# EasyEDA Pro project 51单片机核心板.eprj

# Schematic 51单片机核心板原理图
Board Name: 51单片机核心板; Create Date: 2025-05-13; Page Name: P1; Project Name: 51单片机核心板; Schematic Name: 51单片机核心板原理图; Update Date: 2025-05-13; Company: 辽宁工业大学; Drawed: 含生; Page Size: A4; Version: V1.0
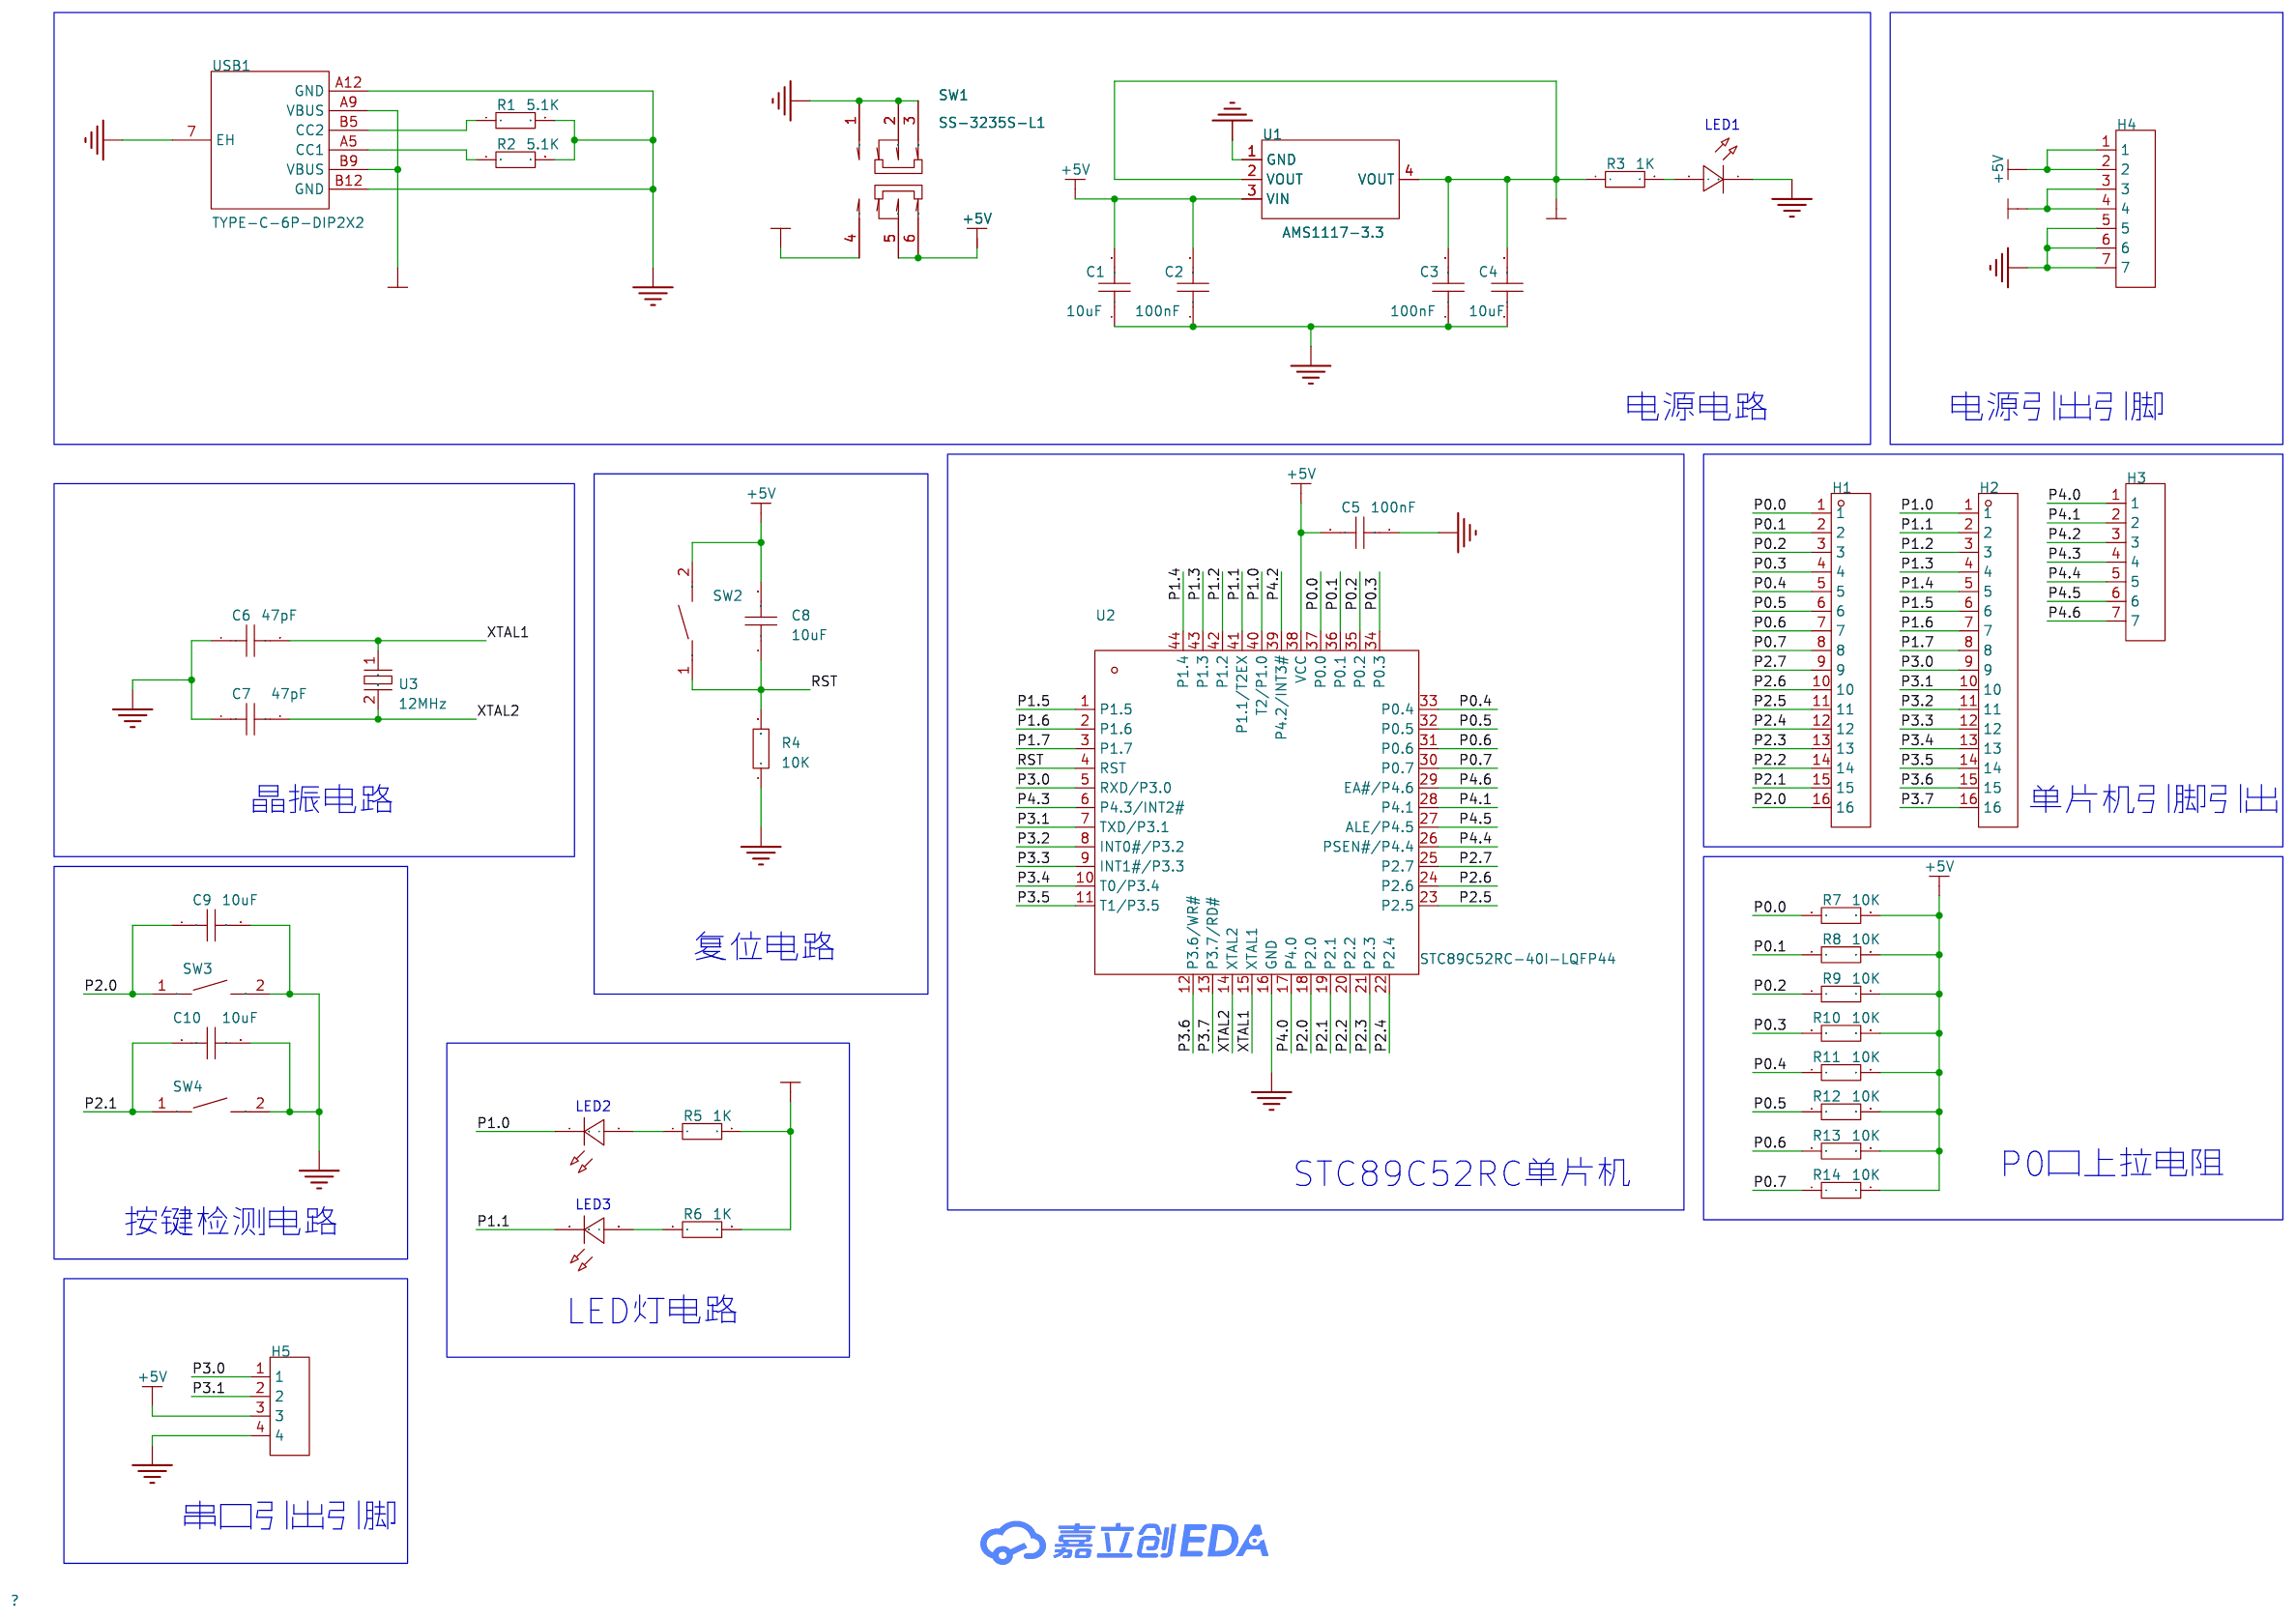
[diagram p0: schematic sheet]

## Parts
C1  10uF  [C0805]
C2  100nF  [C0805]
C3  100nF  [C0805]
C4  10uF  [C0805]
C5  100nF  [C0805]
C6  47pF  [C0805]
C7  47pF  [C0805]
C8  10uF  [C0805]
C9  10uF  [C0805]
C10  10uF  [C0805]
H1  -  [HDR-TH_16P-P2.54-V-M]
H2  -  [HDR-TH_16P-P2.54-V-M]
H3  -  [HDR-TH_7P-P2.54-V-M]
H4  -  [HDR-TH_7P-P2.54-V-M]
H5  -  [HDR-TH_4P-P2.54-V-M]
LED1  -  [LED_0805]
LED2  -  [LED_0805]
LED3  -  [LED_0805]
R1  5.1K  [R0805]
R2  5.1K  [R0805]
R3  1K  [R0805]
R4  10K  [R0805]
R5  1K  [R0805]
R6  1K  [R0805]
R7  10K  [R0805]
R8  10K  [R0805]
R9  10K  [R0805]
R10  10K  [R0805]
R11  10K  [R0805]
R12  10K  [R0805]
R13  10K  [R0805]
R14  10K  [R0805]
SW1  SS-3235S-L1  [SW-SMD_SS-3235S-LX]
SW2  轻触按键3*4*H  [SW-SMD_L4.0-W2.9-LS5.0]
SW3  轻触按键3*4*H  [SW-SMD_L4.0-W2.9-LS5.0]
SW4  轻触按键3*4*H  [SW-SMD_L4.0-W2.9-LS5.0]
U1  AMS1117-3.3  [SOT-223-3_L6.5-W3.4-P2.30-LS7.0-BR]
U2  STC89C52RC-40I-LQFP44  [LQFP-44_L10.0-W10.0-P0.80-LS12.0-BL]
U3  12MHz  [CRYSTAL-SMD_L11.4-W4.7-LS12.7]
USB1  TYPE-C-6P-DIP2X2  [TYPE-C-SMD_TYPE-C-6P]

## Library data of the parts
C1-C10 = CAP_0805: Supplier Footprint: 0805
H1 H2 = HDR-M_2.54_1x16P: Supplier Part: C2894939; Supplier Footprint: 插件
H3 H4 = HDR-M_2.54_1x7P: Supplier Part: C492406; Supplier Footprint: 插件
H5 = HDR-M_2.54_1x4P: Supplier Part: C492403; Supplier Footprint: 插件
LED1-LED3 = LED_0805-G: Supplier Footprint: 0805
R1-R14 = Res_0805: Supplier Footprint: 0805
SW1 = SS-3235S-L1: LCSC Part Name: 柄长2mm 卧贴双档 滑动开关; Supplier Part: C500055; Manufacturer: XKB Connectivity(中国星坤); Supplier Footprint: SMD; JLCPCB Part Class: 扩展库; Datasheet: https://atta.szlcsc.com/upload/public/pdf/source/20211011/39D516E750C13BE9339464E723D9F132.pdf; Supplier: LCSC; Circuit: 双刀双掷; Actuator Style: 矩形柱状; Pin Style: 鸥翼型; Switch Length: 9.1mm; Switch Width: 3.55mm; Switch Height: 3.2mm; Mounting Style: 卧贴; Actuator Color: 黑色; Current Rating (DC): 50mA; Voltage Rating (DC): 12V; Current Rating (AC): 50mA; Voltage Rating (AC): 12V; Mechanical Life: 1万次; Operating Temperature: -40℃~+85℃
SW2-SW4 = 轻触按键3*4*H: Supplier Part: C9900017573; Supplier Footprint: 轻触按键3*4*2.5; JLCPCB Part Class: 扩展库; Supplier: LCSC
U1 = AMS1117-3.3_C6186: LCSC Part Name: 输出3.3V 1A; Supplier Part: C6186; Manufacturer: AMS; Supplier Footprint: SOT-223; JLCPCB Part Class: 基础库; Datasheet: https://atta.szlcsc.com/upload/public/pdf/source/20180727/C6186_7A095716F0823C02F1997A905E26C086.pdf; Supplier: LCSC; Output Type: 固定; Output Voltage: 3.3V; Output Current: 1A; Power Supply Rejection Ratio (PSRR): 72dB@(120Hz); Voltage Dropout: 1.3V@(800mA); Features: 过流保护(OCP)；热关断(TSD); Output Configuration: 正极; Number of Outputs: 1
U2 = STC89C52RC-40I-LQFP44: Supplier Part: C8707; Manufacturer: STC; Supplier Footprint: LQFP-44(10x10); JLCPCB Part Class: 扩展库; Datasheet: https://atta.szlcsc.com/upload/public/pdf/source/20241226/242305099CBBF4767F79975207B2F263.pdf; Supplier: LCSC; CPU Core: 51系列; Program Storage Size: 8KB; Program Memory Type: FLASH; Number of I/O: 39; Low Voltage Detection Threshold: 3.3V~5.5V
U3 = ABLS-12.000MHZ-B4H-T: LCSC Part Name: 12MHz ±30ppm 18pF; Supplier Part: C1986452; Manufacturer: ABRACON; Supplier Footprint: HC-49S-SMD; JLCPCB Part Class: 扩展库; Datasheet: https://atta.szlcsc.com/upload/public/pdf/source/20210612/96A8D0E14BE5C26ADD56CBF11909D043.pdf; Supplier: LCSC; Normal temperature Frequency Tolerance: ±30ppm; External load capacitor: 18pF; Frequency Stability(Full temperature range): ±35ppm; Equivalent Series Resistance (ESR): 50Ω; Operating Temperature: -20℃~+70℃
USB1 = TYPE-C-6P-DIP2X2: Supplier Part: C9900017627; Supplier Footprint: TYPE-C-6P; JLCPCB Part Class: 扩展库; Supplier: LCSC

## Nets
3.3V: C3.2 C4.2 H4.3 H4.4 R3.1 R5.2 R6.2 U1.2(VOUT) U1.4(VOUT)
+5V: C1.2 C2.2 C5.2 C8.2 H4.1 H4.2 H5.3 R7.2 R8.2 R9.2 R10.2 R11.2 R12.2 R13.2 R14.2 SW1.5 SW1.6 SW2.2 U1.3(VIN) U2.38(VCC)
GND: C1.1 C2.1 C3.1 C4.1 C5.1 C6.1 C7.1 C9.2 C10.2 H4.5 H4.6 H4.7 H5.4 LED1.1(C) R1.2 R2.2 R4.1 SW1.1 SW1.2 SW1.3 SW3.2 SW4.2 U1.1(GND) U2.16(GND) USB1.7(EH) USB1.A12(GND) USB1.B12(GND)
VCC+5V: SW1.4 USB1.A9(VBUS) USB1.B9(VBUS)
P0.0: H1.1 R7.1 U2.37(P0.0)
P0.1: H1.2 R8.1 U2.36(P0.1)
P0.2: H1.3 R9.1 U2.35(P0.2)
P0.3: H1.4 R10.1 U2.34(P0.3)
P0.4: H1.5 R11.1 U2.33(P0.4)
P0.5: H1.6 R12.1 U2.32(P0.5)
P0.6: H1.7 R13.1 U2.31(P0.6)
P0.7: H1.8 R14.1 U2.30(P0.7)
P1.0: H2.1 LED2.1(C) U2.40(T2/P1.0)
P1.1: H2.2 LED3.1(C) U2.41(P1.1/T2EX)
P1.2: H2.3 U2.42(P1.2)
P1.3: H2.4 U2.43(P1.3)
P1.4: H2.5 U2.44(P1.4)
P1.5: H2.6 U2.1(P1.5)
P1.6: H2.7 U2.2(P1.6)
P1.7: H2.8 U2.3(P1.7)
P2.0: C9.1 H1.16 SW3.1 U2.18(P2.0)
P2.1: C10.1 H1.15 SW4.1 U2.19(P2.1)
P2.2: H1.14 U2.20(P2.2)
P2.3: H1.13 U2.21(P2.3)
P2.4: H1.12 U2.22(P2.4)
P2.5: H1.11 U2.23(P2.5)
P2.6: H1.10 U2.24(P2.6)
P2.7: H1.9 U2.25(P2.7)
P3.0: H2.9 H5.1 U2.5(RXD/P3.0)
P3.1: H2.10 H5.2 U2.7(TXD/P3.1)
P3.2: H2.11 U2.8(INT0#/P3.2)
P3.3: H2.12 U2.9(INT1#/P3.3)
P3.4: H2.13 U2.10(T0/P3.4)
P3.5: H2.14 U2.11(T1/P3.5)
P3.6: H2.15 U2.12(P3.6/WR#)
P3.7: H2.16 U2.13(P3.7/RD#)
P4.0: H3.1 U2.17(P4.0)
P4.1: H3.2 U2.28(P4.1)
P4.2: H3.3 U2.39(P4.2/INT3#)
P4.3: H3.4 U2.6(P4.3/INT2#)
P4.4: H3.5 U2.26(PSEN#/P4.4)
P4.5: H3.6 U2.27(ALE/P4.5)
P4.6: H3.7 U2.29(EA#/P4.6)
RST: C8.1 R4.2 SW2.1 U2.4(RST)
XTAL1: C6.2 U2.15(XTAL1) U3.1
XTAL2: C7.2 U2.14(XTAL2) U3.2(GND)
$1N235: R1.1 USB1.B5(CC2)
$1N239: R2.1 USB1.A5(CC1)
$1N947: LED1.2(A) R3.2
$1N3257: LED2.2(A) R5.1
$1N3279: LED3.2(A) R6.1

## Notes on the sheet
- 电源电路
- 电源引出引脚
- 晶振电路
- 单片机引脚引出
- 复位电路
- P0口上拉电阻
- STC89C52RC单片机
- 按键检测电路
- LED灯电路
- 串口引出引脚

# Board 51单片机核心板PCB
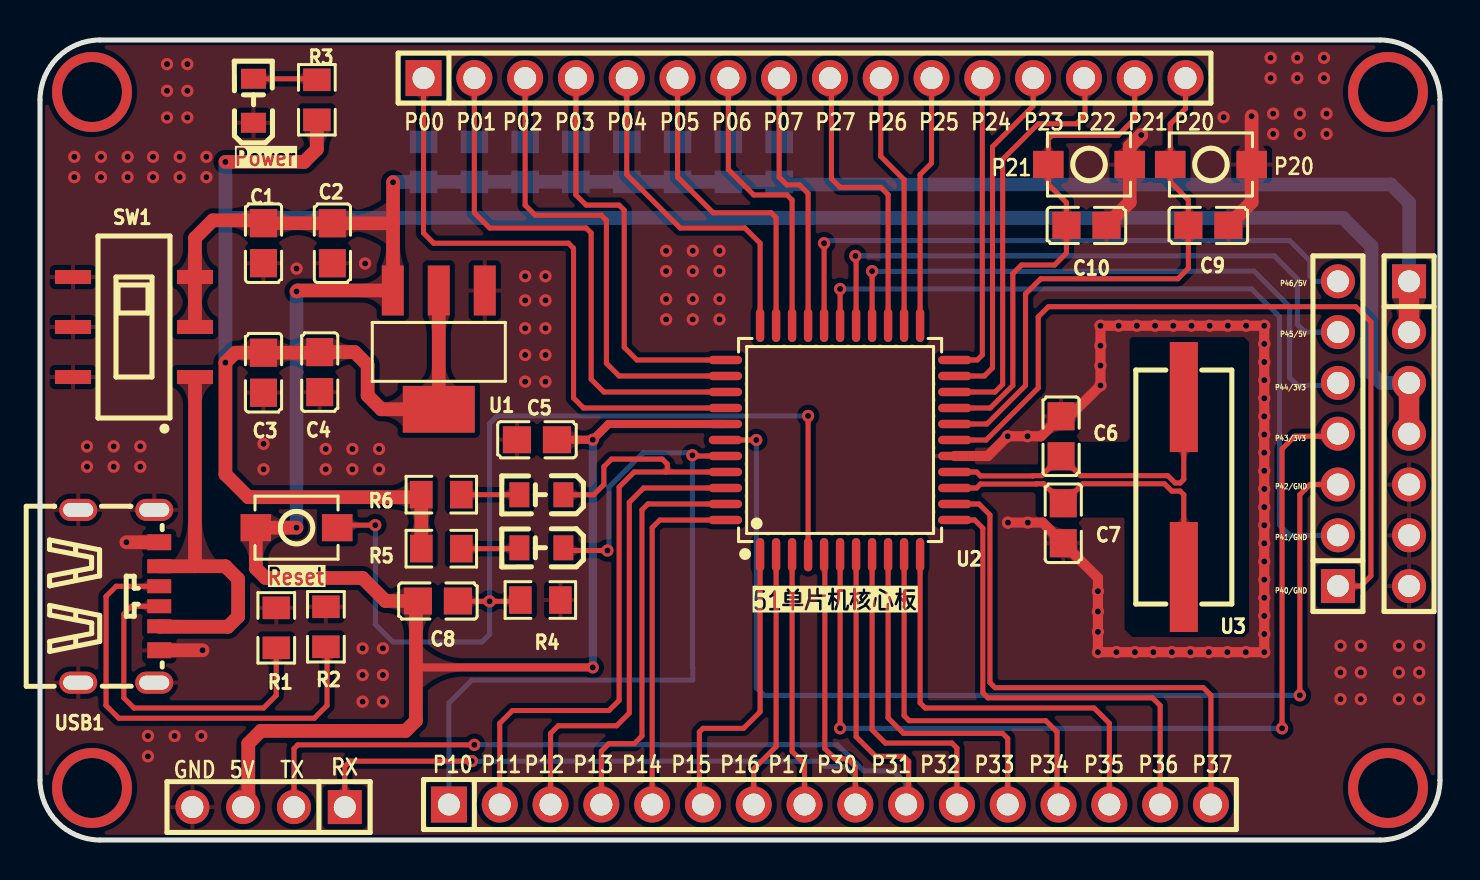
[diagram p1: board, top side]
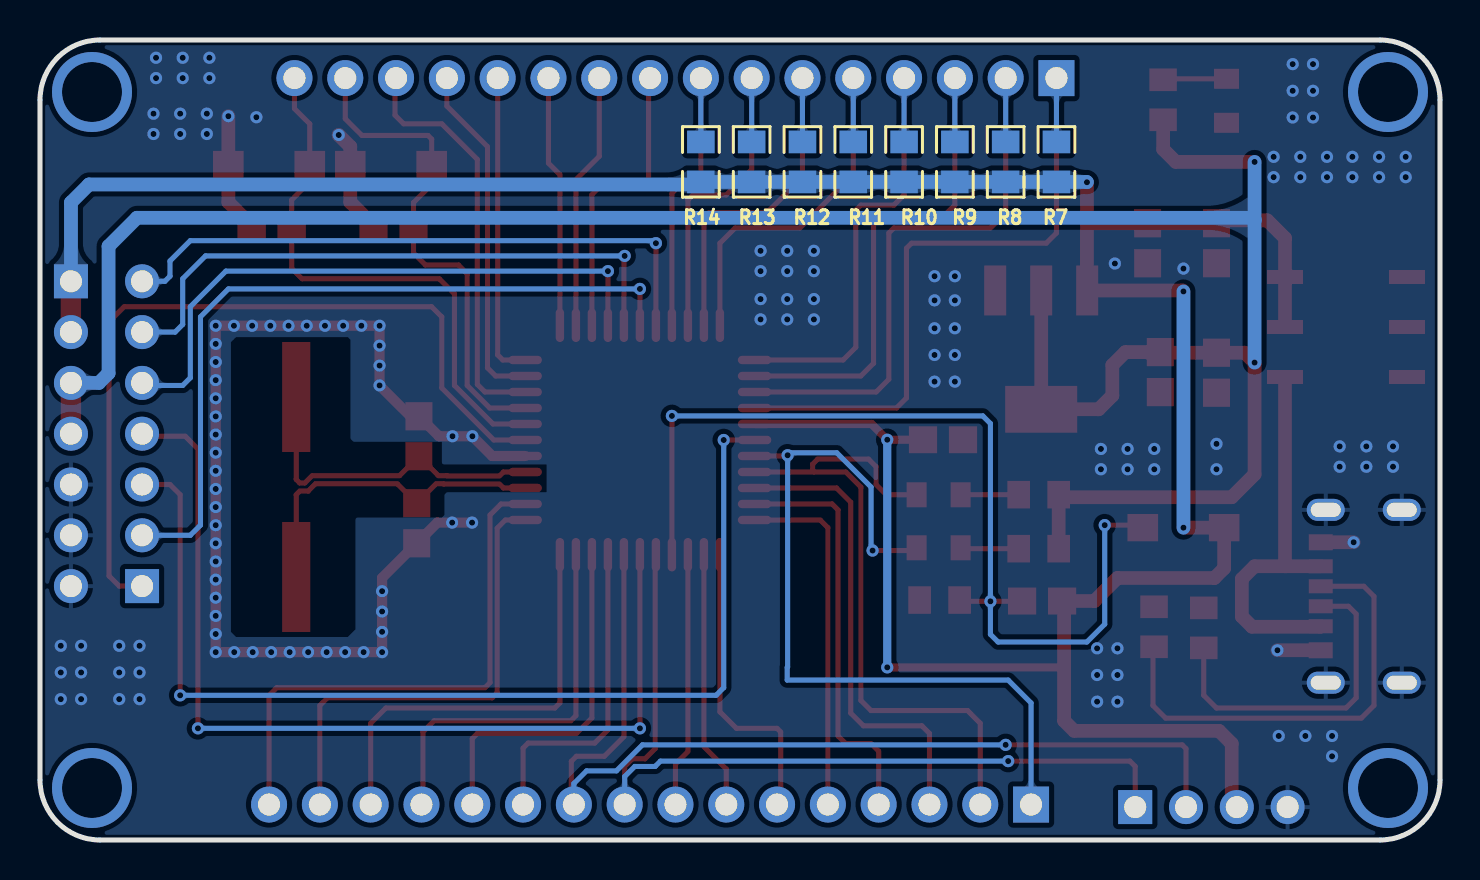
[diagram p2: board, bottom side, seen from below]

Outline 70 x 40 mm; copper layers: Top Layer, Bottom Layer. Coordinates in mm from the lower left corner of the outline.
Outline path: 0,37 0,3 arc(0.88,0.88) 3,0 67,0 arc(69.12,0.88) 70,3 70,37 arc(69.12,39.12) 67,40 3,40 arc(0.88,39.12) 0,37
Stack: Top Layer 0.035mm / Dielectric1 1.51mm FR4 er 4.5 / Bottom Layer 0.035mm

## Design rules (mm)
net XTAL1: DP1
net XTAL2: DP1
template: JLCPCB Capability(Two Layers Board)
spacing copperThickness1oz (default): track to track 0.102, other pairs 0.152 to 0.3
spacing copperThickness2oz: track to track 0.203, other pairs 0.152 to 0.3
track width copperThickness1oz (default): min 0.127, default 0.254, max 2.54
track width copperThickness2oz: min 0.203, default 0.254, max 2.54
differential pair differentialPair (default): width min 0.127, default 0.254, max 2.54; gap min 0.152, default 0.152
via viaSize (default): diameter min 0.5, default 0.61, max 10; hole min 0.3, default 0.305, max 6.3

## Placement (name value [footprint] x y rotation side)
C1  10uF  [C0805]  11.18 29.84 90 top
C2  100nF  [C0805]  14.62 29.84 90 top
C3  100nF  [C0805]  11.18 23.36 90 top
C4  10uF  [C0805]  13.99 23.4 90 top
C5  100nF  [C0805]  24.85 20.01 0 top
C6  47pF  [C0805]  51.05 20.19 270 top
C7  47pF  [C0805]  51.16 15.84 90 top
C8  10uF  [C0805]  19.9 11.95 180 top
C9  10uF  [C0805]  58.42 30.73 0 top
C10  10uF  [C0805]  52.32 30.73 0 top
H1  -  [HDR-TH_16P-P2.54-V-M]  38.23 38.09 0 top
H2  -  [HDR-TH_16P-P2.54-V-M]  39.5 1.77 0 top
H3  -  [HDR-TH_7P-P2.54-V-M]  64.9 20.31 90 top
H4  -  [HDR-TH_7P-P2.54-V-M]  68.45 20.31 270 top
H5  -  [HDR-TH_4P-P2.54-V-M]  11.43 1.65 180 top
LED1  -  [LED_0805]  10.68 37.01 90 top
LED2  -  [LED_0805]  25.02 14.61 180 top
LED3  -  [LED_0805]  25.02 17.27 180 top
R1  5.1K  [R0805]  11.81 10.61 90 top
R2  5.1K  [R0805]  14.3 10.66 90 top
R3  1K  [R0805]  13.84 37.01 90 top
R4  10K  [R0805]  25.02 12 180 top
R5  1K  [R0805]  20.07 14.57 180 top
R6  1K  [R0805]  20.07 17.27 180 top
R7  10K  [R0805]  19.18 33.9 270 bottom
R8  10K  [R0805]  21.72 33.9 270 bottom
R9  10K  [R0805]  24.26 33.9 270 bottom
R10  10K  [R0805]  26.8 33.9 270 bottom
R11  10K  [R0805]  29.34 33.9 270 bottom
R12  10K  [R0805]  31.88 33.9 270 bottom
R13  10K  [R0805]  34.42 33.9 270 bottom
R14  10K  [R0805]  36.96 33.9 270 bottom
SW1  SS-3235S-L1  [SW-SMD_SS-3235S-LX]  4.7 25.65 90 top
SW2  轻触按键3*4*H  [SW-SMD_L4.0-W2.9-LS5.0]  12.83 15.62 180 top
SW3  轻触按键3*4*H  [SW-SMD_L4.0-W2.9-LS5.0]  58.55 33.78 0 top
SW4  轻触按键3*4*H  [SW-SMD_L4.0-W2.9-LS5.0]  52.45 33.78 0 top
U1  AMS1117-3.3  [SOT-223-3_L6.5-W3.4-P2.30-LS7.0-BR]  19.94 24.51 90 top
U2  STC89C52RC-40I-LQFP44  [LQFP-44_L10.0-W10.0-P0.80-LS12.0-BL]  40 20 0 top
U3  12MHz  [CRYSTAL-SMD_L11.4-W4.7-LS12.7]  57.19 17.65 270 top
USB1  TYPE-C-6P-DIP2X2  [TYPE-C-SMD_TYPE-C-6P]  3.94 12.19 270 top

## Footprints (pads in the part's own frame, mm; a bottom-side part is the same pattern mirrored in y, then rotated)
C0805
  rect 1.41x1.35 smd: 1(-1,0) 2(1,0)
CRYSTAL-SMD_L11.4-W4.7-LS12.7
  rect 5.5x1.4 smd: 1(-4.5,0) 2(4.5,0)
HDR-TH_4P-P2.54-V-M
  rect 1.7x1.7 hole 1.1: 1(-3.81,0)
  round 1.7 hole 1.1: 2(-1.27,0) 3(1.27,0) 4(3.81,0)
HDR-TH_7P-P2.54-V-M
  rect 1.7x1.7 hole 1.1: 1(-7.62,0)
  round 1.7 hole 1.1: 2(-5.08,0) 3(-2.54,0) 4(0,0) 5(2.54,0) 6(5.08,0) 7(7.62,0)
HDR-TH_16P-P2.54-V-M
  rect 1.8x1.8 hole 1.1: 1(-19.05,0)
  round 1.8 hole 1.1: 2(-16.51,0) 3(-13.97,0) 4(-11.43,0) 5(-8.89,0) 6(-6.35,0) 7(-3.81,0) 8(-1.27,0) 9(1.27,0) 10(3.81,0) 11(6.35,0) 12(8.89,0) 13(11.43,0) 14(13.97,0) 15(16.51,0) 16(19.05,0)
LED_0805
  rect 1x1.25 smd: 1(-1.15,0.005) 2(1.05,0.005)
LQFP-44_L10.0-W10.0-P0.80-LS12.0-BL
  oval 0.42x1.67 smd: 1(-4,-5.735) 2(-3.2,-5.735) 3(-2.4,-5.735) 4(-1.6,-5.735) 5(-0.8,-5.735) 6(0,-5.735) 7(0.8,-5.735) 8(1.6,-5.735) 9(2.4,-5.735) 10(3.2,-5.735) 11(4,-5.735) 23(4,5.735) 24(3.2,5.735) 25(2.4,5.735) 26(1.6,5.735) 27(0.8,5.735) 28(0,5.735) 29(-0.8,5.735) 30(-1.6,5.735) 31(-2.4,5.735) 32(-3.2,5.735) 33(-4,5.735)
  oval 1.67x0.42 smd: 12(5.735,-4) 13(5.735,-3.2) 14(5.735,-2.4) 15(5.735,-1.6) 16(5.735,-0.8) 17(5.735,0) 18(5.735,0.8) 19(5.735,1.6) 20(5.735,2.4) 21(5.735,3.2) 22(5.735,4) 34(-5.735,4) 35(-5.735,3.2) 36(-5.735,2.4) 37(-5.735,1.6) 38(-5.735,0.8) 39(-5.735,0) 40(-5.735,-0.8) 41(-5.735,-1.6) 42(-5.735,-2.4) 43(-5.735,-3.2) 44(-5.735,-4)
R0805
  rect 1.133x1.377 smd: 1(-1,0) 2(1,0)
SOT-223-3_L6.5-W3.4-P2.30-LS7.0-BR
  rect 2.5x1.1 smd: 1(2.97,-2.3) 2(2.97,0) 3(2.97,2.3)
  rect 2.34x3.6 smd: 4(-2.97,0)
SW-SMD_L4.0-W2.9-LS5.0
  rect 1.53x1.36 smd: 1(-2.035,0) 2(2.035,0)
SW-SMD_SS-3235S-LX
  rect 0.7x1.8 smd: 1(-2.5,3.05) 2(0,3.05) 3(2.5,3.05) 4(-2.5,-3.05) 5(0,-3.05) 6(2.5,-3.05)
TYPE-C-SMD_TYPE-C-6P
  oval 1.1x1.9 hole 0.7x1.5: 7(-4.32,1.775) 7(-4.32,-2.025) 7(4.32,1.775) 7(4.32,-2.025)
  rect 0.7x1.2 smd: A5(-0.5,2.025) A9(1.5,2.025) B5(0.5,2.025) B9(-1.5,2.025)
  rect 0.8x1.2 smd: A12(2.7,2.025) B12(-2.7,2.025)

## Nets
As in the schematic.

## Via types
v1: diameter 4, hole 3, Top Layer to Bottom Layer, 4 vias
v2: diameter 0.61, hole 0.305, Top Layer to Bottom Layer, 164 vias

## Routing (per net, layer and track width the routed paths; a pad name or vN(x,y) marks a point on that pad's centre or on a via; arc(x,y) is an arc through that point)
3.3V: length 122.8
  Top Layer w0.686: R5.2 R6.2 18.94,17.14 10.41,17.14 9.27,18.28 v2(9.27,23.87) 9.76,24.36 C3.2 14.59,24.36 14.62,24.4 15.73,24.4 16.38,23.74 16.38,22.22 17.07,21.54 U1.4 U1.2 ; R3.1 13.84,34.54 13.21,33.9 v2(9.27,33.9)
  Top Layer w1.016: H4.3 H4.4
  Bottom Layer w0.686: v2(9.27,23.87) 9.27,30.99 ; 9.27,30.99 v2(9.27,33.9) ; 9.27,30.99 9.39,31.11 65.15,31.11 66.57,29.69 66.57,23.34 67.06,22.86 H4.3
+5V: length 154.7
  Top Layer w0.406: C5.2 v2(27.64,20.01) 28.43,20.8 U2.38 ; v2(27.64,8.63) 18.89,8.63 18.8,8.54
  Top Layer w0.686: 7.49,28.19 7.75,27.93 SW1.5 ; 17.65,30.86 17.63,30.84 C2.2 14.62,30.84 C1.2 11.03,30.98 8.64,30.98 7.75,30.09 SW1.6 ; 17.65,30.86 v2(17.65,32.89) ; 17.65,30.86 17.65,27.49 U1.3 12.88,27.48 v2(12.83,27.43) ; H5.3 10.41,1.9 10.41,4.82 11.05,5.46 18.29,5.46 18.8,5.96 18.8,11.85 C8.2 17.28,11.95 16.13,13.1 11.28,13.1 10.8,13.58 10.8,15.61 SW2.2 v2(12.83,15.62)
  Top Layer w1.016: H4.1 H4.2
  Bottom Layer w0.406: v2(27.64,20.01) v2(27.64,8.63)
  Bottom Layer w0.686: v2(17.65,32.89) 17.67,32.9 R7.2 R8.2 R9.2 R10.2 R11.2 R12.2 R13.2 R14.2 37.08,32.78 67.55,32.78 68.45,31.87 68.45,28.32 68.2,28.06 ; v2(12.83,15.62) v2(12.83,27.43)
GND: length 68.9
  Top Layer w0.508: v2(48.4,15.87) v2(49.39,15.87) 50.13,15.87 C7.1 52.9,13.11 v2(52.9,12.44) v2(52.9,11.42) v2(52.9,10.41) v2(52.9,9.39) v2(53.82,9.39) v2(54.74,9.39) v2(55.67,9.39) v2(56.59,9.39) v2(57.52,9.39) v2(58.44,9.39) v2(59.37,9.39) v2(60.29,9.39) v2(61.21,9.39) v2(61.21,10.3) v2(61.21,11.21) v2(61.21,12.11) v2(61.21,13.02) v2(61.21,13.93) v2(61.21,14.83) v2(61.21,15.74) v2(61.21,16.65) v2(61.21,17.55) v2(61.21,18.46) v2(61.21,19.37) v2(61.21,20.27) v2(61.21,21.18) v2(61.21,22.09) v2(61.21,22.99) v2(61.21,23.9) v2(61.21,24.81) v2(61.21,25.71) v2(60.3,25.71) v2(59.39,25.71) v2(58.48,25.71) v2(57.57,25.71) v2(56.66,25.71) v2(55.75,25.71) v2(54.84,25.71) v2(53.93,25.71) v2(53.02,25.71) v2(53.02,24.72) v2(53.02,23.72) v2(53.02,22.73) 51.48,21.19 C6.1 50.05,20.19 v2(49.38,20.19) v2(48.38,20.19) 47.39,19.2 U2.16
  Top Layer w0.686: USB1.B12 v2(4.32,14.89) ; C9.2 60.58,31.89 SW3.2 v2(60.58,36.19) ; C10.2 54.49,31.89 SW4.2 54.49,34.67 55.06,35.25 v2(55.06,35.25) ; USB1.A12 v2(8.13,9.49)
  vias: v2(1.71,34.16) v2(1.71,33.14) v2(2.35,19.68) v2(2.35,18.66) v2(3.05,34.16) v2(3.05,33.14) v2(3.68,19.68) v2(3.68,18.66) v2(4.38,34.16) v2(4.38,33.14) v2(5.02,19.68) v2(5.02,18.66) v2(5.4,5.2) v2(5.4,4.19) v2(5.65,34.16) v2(5.65,33.14) v2(6.35,38.79) v2(6.35,37.46) v2(6.35,36.13) v2(6.73,5.2) v2(6.98,34.16) v2(6.98,33.14) v2(7.37,38.79) v2(7.37,37.46) v2(7.37,36.13) v2(8.06,5.2) v2(8.32,34.16) v2(8.32,33.14) v2(11.18,19.81) v2(11.18,18.54) v2(12.83,28.57) v2(14.29,19.55) v2(14.29,18.54) v2(15.62,19.55) v2(15.62,18.54) v2(16.13,9.58) v2(16.13,8.25) v2(16.13,6.92) v2(16.26,28.82) v2(16.95,19.55) v2(16.95,18.54) v2(17.14,9.58) v2(17.14,8.25) v2(17.14,6.92) v2(24.26,28.19) v2(24.26,26.98) v2(24.26,25.59) v2(24.26,24.25) v2(24.26,22.92) v2(25.27,28.19) v2(25.27,26.98) v2(25.27,25.59) v2(25.27,24.25) v2(25.27,22.92) v2(31.31,29.46) v2(31.31,28.44) v2(31.31,27.05) v2(31.31,26.03) v2(32.64,29.46) v2(32.64,28.44) v2(32.64,27.05) v2(32.64,26.03) v2(33.97,29.46) v2(33.97,28.44) v2(33.97,27.05) v2(33.97,26.03) v2(59.18,36.14) v2(61.53,39.11) v2(61.53,38.09) v2(61.66,36.32) v2(61.66,35.3) v2(62.87,39.11) v2(62.87,38.09) v2(62.99,36.32) v2(62.99,35.3) v2(64.2,39.11) v2(64.2,38.09) v2(64.33,36.32) v2(64.33,35.3) v2(65.02,9.71) v2(65.02,8.38) v2(65.02,7.04) v2(66.04,9.71) v2(66.04,8.38) v2(66.04,7.04) v2(67.94,9.71) v2(67.94,8.38) v2(67.94,7.04) v2(68.96,9.71) v2(68.96,8.38) v2(68.96,7.04)
VCC+5V: length 19.7
  Top Layer w0.686: USB1.A9 5.99,10.66 9.4,10.66 9.91,11.17 9.91,13.05 9.27,13.69 7.74,13.69 ; 7.74,13.69 7.75,13.7 SW1.4 ; 7.74,13.69 USB1.B9
(no net):
  vias: v1(2.6,37.4) v1(2.6,2.6) v1(67.4,37.4) v1(67.4,2.6)
P0.0: length 34
  Top Layer w0.254: H1.1 19.18,30.35 19.69,29.84 26.42,29.84 26.68,29.59 26.68,22.1 27.18,21.6 U2.37
  Bottom Layer w0.254: H1.1 R7.1
P0.1: length 30.5
  Top Layer w0.254: U2.36 28.19,22.4 27.56,23.03 27.56,30.35 27.31,30.6 22.48,30.6 21.72,31.36 H1.2
  Bottom Layer w0.254: H1.2 R8.1
P0.2: length 27.3
  Top Layer w0.254: H1.3 24.26,31.75 24.76,31.24 28.07,31.24 28.32,30.98 28.32,23.83 28.96,23.2 U2.35
  Bottom Layer w0.254: H1.3 R9.1
P0.3: length 23.9
  Top Layer w0.254: H1.4 26.8,32.25 27.31,31.75 28.96,31.75 29.21,31.49 29.21,24.64 29.84,24 U2.34
  Bottom Layer w0.254: H1.4 R10.1
P0.4: length 20.2
  Top Layer w0.254: H1.5 29.34,33.27 32,30.6 35.24,30.6 36,29.84 U2.33
  Bottom Layer w0.254: H1.5 R11.1
P0.5: length 19.3
  Top Layer w0.254: H1.6 31.88,33.14 33.66,31.36 36.55,31.36 36.81,31.11 U2.32
  Bottom Layer w0.254: H1.6 R12.1
P0.6: length 17.8
  Top Layer w0.254: H1.7 34.42,33.52 35.69,32.25 37.35,32.25 37.6,32 U2.31
  Bottom Layer w0.254: H1.7 R13.1
P0.7: length 16.5
  Top Layer w0.254: U2.30 38.41,32.33 37.97,32.76 37.34,32.76 36.96,33.14 H1.8
  Bottom Layer w0.254: H1.8 R14.1
P1.0: length 41.1
  Top Layer w0.254: v2(32.62,19.24) 32.66,19.2 U2.40 ; LED2.1 26.31,14.47 v2(28.37,14.47)
  Bottom Layer w0.254: H2.1 20.45,6.85 21.59,8 32.64,8 32.64,8.63 32.62,8.65 v2(32.62,19.24) 32.5,19.36 30.16,19.36 28.45,17.65 28.45,14.55 v2(28.37,14.47)
P1.1: length 33.8
  Top Layer w0.254: H2.2 22.99,5.84 23.62,6.47 28.45,6.47 28.96,6.98 28.96,17.65 29.71,18.4 31.28,18.4 ; 31.28,18.4 U2.41 ; 31.28,18.4 31.37,18.49 31.37,18.79 31.12,19.05 28.57,19.05 28.19,18.66 28.19,17.78 27.68,17.26 LED3.1
P1.2: length 23.6
  Top Layer w0.254: U2.42 30.18,17.6 29.46,16.89 29.46,6.34 28.83,5.71 25.91,5.71 25.53,5.33 H2.3
P1.3: length 20.6
  Top Layer w0.254: H2.4 28.07,4.44 28.45,4.82 29.72,4.82 30.1,5.2 30.1,16.5 30.39,16.8 U2.43
P1.4: length 17.7
  Top Layer w0.254: U2.44 34.27,16 30.99,16 30.61,15.62 H2.5
P1.5: length 15
  Top Layer w0.254: U2.1 36,6.41 35.18,5.58 33.15,5.58 32.97,5.4 32.97,1.95 H2.6
P1.6: length 13
  Top Layer w0.254: U2.2 36.81,4.67 35.69,3.55 H2.7
P1.7: length 12.7
  Top Layer w0.254: U2.3 37.6,4.43 38.23,3.81 H2.8
P2.0: length 27.8
  Top Layer w0.254: 57.28,38.09 57.28,36.57 56.51,35.81 SW3.1 56.51,32.91 57.42,32 C9.1 57.42,28.58 56.9,28.06 50.04,28.06 49.28,27.3 49.28,22.73 47.35,20.8 U2.18
P2.1: length 24.9
  Top Layer w0.254: H1.15 54.74,36.06 53.9,35.23 50.6,35.23 50.42,35.04 SW4.1 50.42,32.78 51.32,31.87 C10.1 51.32,29.35 50.73,28.75 49.07,28.75 48.64,28.32 48.64,22.73 47.51,21.6 U2.19
P2.2: length 20.7
  Top Layer w0.254: H1.14 52.25,38.04 52.25,36.24 51.82,35.81 49.91,35.81 48.13,34.03 48.13,22.78 47.75,22.4 U2.20
P2.3: length 17.4
  Top Layer w0.254: H1.13 49.66,36.7 47.62,34.67 47.62,23.61 47.22,23.2 U2.21
P2.4: length 15.3
  Top Layer w0.254: U2.22 46.86,24 47.12,24.25 47.12,38.09
P2.5: length 12.6
  Top Layer w0.254: U2.23 44,33.27 44.58,33.84 H1.11
P2.6: length 12.8
  Top Layer w0.254: U2.24 43.21,33.02 42.04,34.18 H1.10
P2.7: length 14.8
  Top Layer w0.254: U2.25 42.41,32.27 42.04,32.63 40,32.63 39.57,33.07 39.57,38.02 H1.9
P3.0: length 42.9
  Top Layer w0.254: H2.9 40.77,3.68 40.39,4.06 39.75,4.06 39.24,4.57 39.24,14.23 U2.5 ; H5.1 15.24,3.68 15.51,3.94 v2(21.59,3.94)
  Bottom Layer w0.254: H2.9 40.77,3.17 40.26,3.68 39.24,3.68 38.98,3.94 v2(21.59,3.94)
P3.1: length 49.9
  Top Layer w0.254: H2.10 43.43,1.9 43.43,3.93 43.18,4.19 41.78,4.19 40.81,5.16 U2.7 ; H5.2 12.7,4.57 12.89,4.76 v2(21.72,4.76)
  Bottom Layer w0.254: H2.10 43.31,2.82 42.67,3.46 41.18,3.46 39.88,4.76 v2(21.72,4.76)
P3.2: length 16.2
  Top Layer w0.254: U2.8 41.6,5.51 42.27,4.85 45.59,4.85 45.85,4.59 H2.11
P3.3: length 17.9
  Top Layer w0.254: H2.12 48.39,5.08 48.13,5.33 43.18,5.33 42.41,6.1 U2.9
P3.4: length 19.7
  Top Layer w0.254: U2.10 43.21,6.22 43.46,5.96 50.29,5.96 50.85,5.4 50.85,1.85 H2.13
P3.5: length 21.4
  Top Layer w0.254: H2.14 53.47,5.84 52.71,6.6 44.26,6.6 44,6.85 U2.11
P3.6: length 23.9
  Top Layer w0.254: H2.15 56.01,6.73 55.63,7.11 47.4,7.11 47.14,7.36 47.14,15.59 46.73,16 U2.12
P3.7: length 27.1
  Top Layer w0.254: H2.16 58.55,7.23 58.17,7.61 47.75,7.61 47.5,7.87 47.5,16.25 46.95,16.8 U2.13
P4.0: length 40.5
  Top Layer w0.254: H3.1 66.04,12.69 66.55,13.2 66.55,25.9 65.79,26.67 50.42,26.67 49.91,26.16 49.91,22.6 47.31,20 U2.17
P4.1: length 37.9
  Top Layer w0.254: U2.28 v2(40,27.55)
  Bottom Layer w0.254: H3.2 62.48,15.23 61.98,15.74 61.98,26.16 60.58,27.55 v2(40,27.55)
P4.2: length 53.4
  Top Layer w0.254: 64.9,17.78 63.5,17.78 62.99,17.27 v2(62.99,7.23) ; U2.39 v2(35.81,20)
  Bottom Layer w0.254: v2(62.99,7.23) 36.19,7.23 35.81,7.61 v2(35.81,20)
P4.3: length 47.9
  Top Layer w0.254: U2.6 v2(40,5.58) ; v2(62.1,5.58) 62.1,19.55 62.74,20.19 64.77,20.19 H3.4
  Bottom Layer w0.254: v2(40,5.58) v2(62.1,5.58)
P4.4: length 30.5
  Top Layer w0.254: U2.26 v2(41.6,28.44)
  Bottom Layer w0.254: v2(41.6,28.44) 60.71,28.44 62.48,26.67 62.48,23.11 62.87,22.73 64.77,22.73 H3.5
P4.5: length 30.5
  Top Layer w0.254: v2(40.77,29.2) 40.81,29.17 U2.27
  Bottom Layer w0.254: H3.6 63.25,25.39 62.87,25.78 62.87,28.06 61.72,29.2 v2(40.77,29.2)
P4.6: length 31.1
  Top Layer w0.254: U2.29 v2(39.21,29.84)
  Bottom Layer w0.254: H3.7 63.75,27.94 63.5,28.19 63.5,28.95 62.48,29.97 39.33,29.97 v2(39.21,29.84)
RST: length 49.9
  Top Layer w0.254: v2(16.76,15.74) 14.99,15.74 SW2.1 ; U2.4 v2(38.41,21.2) ; C8.1 20.91,11.93 v2(22.48,11.93) 23.95,11.93 R4.2
  Bottom Layer w0.254: v2(16.76,15.74) 16.76,10.79 17.65,9.9 22.1,9.9 22.48,10.28 v2(22.48,11.93) 22.48,20.82 22.86,21.2 v2(38.41,21.2)
XTAL1: length 16.7
  Top Layer w0.254: U2.15 46.83,18.4 47.03,18.2 49.65,18.2 49.66,18.22 50.08,18.22 C6.2 52.03,18.22 56.39,18.22 56.76,17.85 57.01,17.85 57.19,18.03 U3.1
XTAL2: length 16.7
  Top Layer w0.254: U3.2 57.19,17.27 57.01,17.44 56.59,17.44 56.22,17.81 52.14,17.81 C7.2 50.19,17.81 49.83,17.81 49.81,17.8 47.03,17.8 46.83,17.6 U2.14
$1N235: length 16.6
  Top Layer w0.254: USB1.B5 4.58,11.69 4.19,11.3 4.19,7.11 4.7,6.6 11.18,6.6 11.81,7.24 R1.1
$1N239: length 22.9
  Top Layer w0.254: R2.1 14.35,9.61 14.35,6.73 13.72,6.09 3.94,6.09 3.3,6.73 3.3,12.18 3.81,12.69 USB1.A5
$1N947: length 3.2
  Top Layer w0.254: 10.67,38.06 13.79,38.06 R3.2
$1N3257: length 2.9
  Top Layer w0.254: R5.1 23.93,14.57 LED2.2
$1N3279: length 2.9
  Top Layer w0.254: LED3.2 23.96,17.27 R6.1

## Copper pours and planes (outline as drawn; the poured copper is in the pictures)
GND on Top Layer: -0.13,39.87 70.1,39.87 70.1,-0.64 -0.13,-0.64
GND on Bottom Layer: -1.27,40.38 71.37,40.38 71.37,-0.77 -1.27,-0.77

Small or netless copper shapes (teardrops, artwork), in the pictures only: 268 on Top Layer, 61 on Bottom Layer

## Text on the board
Top Silkscreen Layer: P44/3V3 | P43/3V3 | P42/GND | P41/GND | P40/GND | P46/5V | P45/5V | GND | 5V | Power | Reset | TX | RX | P00 | P10 | P01 | P11 | P02 | P12 | P03 | P13 | P04 | P14 | P05 | P15 | P06 | P16 | P07 | P17 | P27 | P30 | P26 | P31 | P25 | P32 | P24 | P33 | P21 | P23 | P34 | P22 | P35 | P36 | P20 | P37 | 51单片机核心板
